# EAGLE design main (EAGLE 5.11)
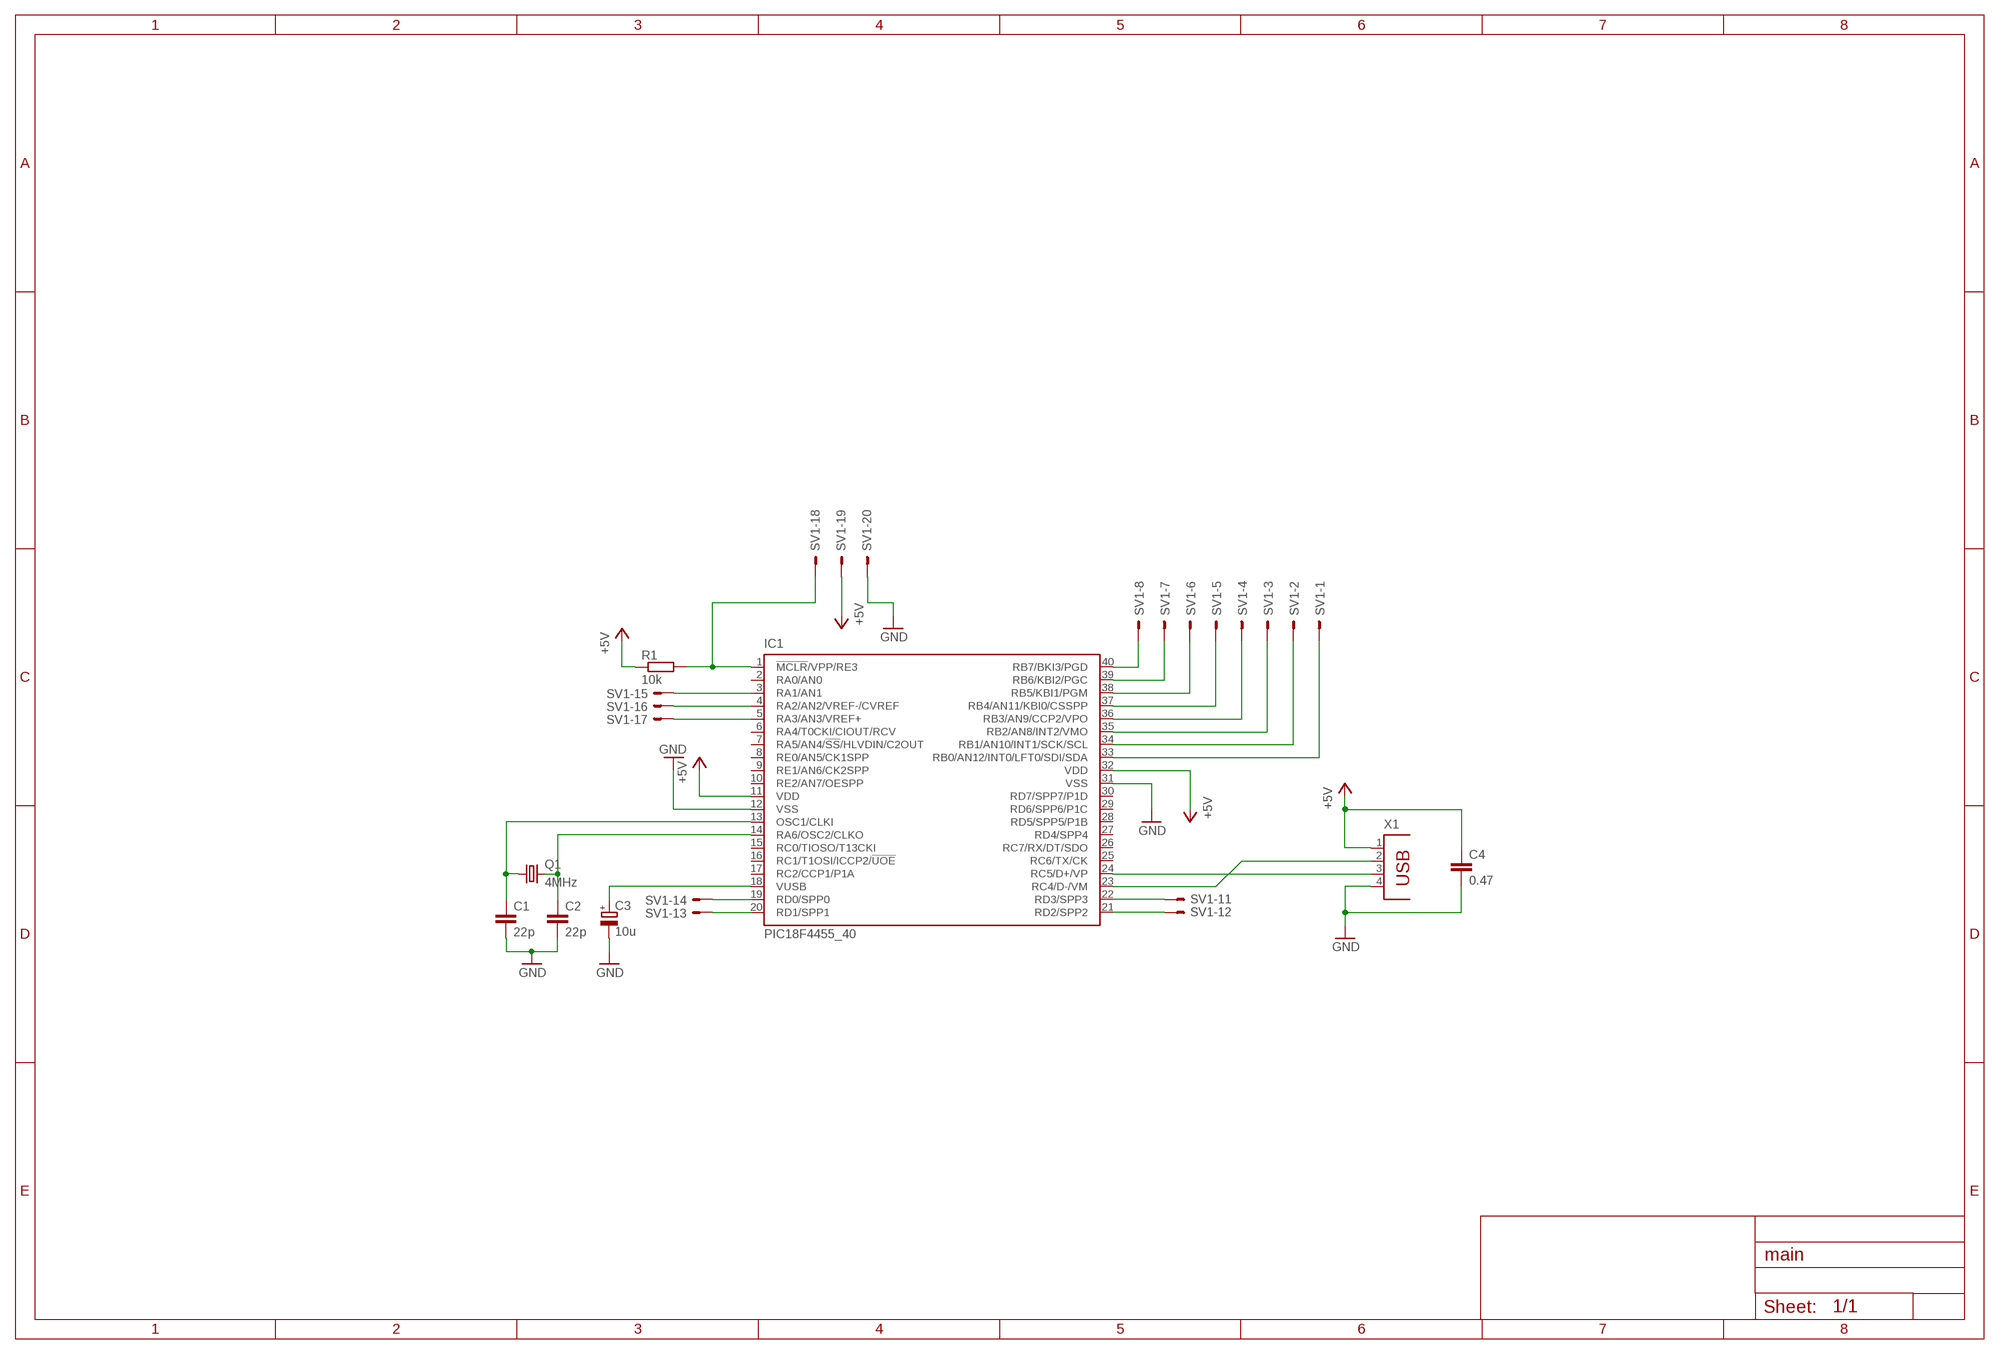
[diagram p0: schematic, sheet 1]

## Parts
C1  22p  C-EU025-030X050  [C025-030X050]
C2  22p  C-EU025-030X050  [C025-030X050]
C3  10u  CPOL-EUE2.5-7  [E2,5-7]
C4  0.47  C-EU025-030X050  [C025-030X050]
IC1  PIC18F4455_40  [DIL40]
Q1  4MHz  CRYSTALHC18U-V  [HC18U-V]
R1  10k  R-EU_0207/10  [0207/10]
SV1  ML20LE  [ML20L]
X1  PN87520  [PN87520]

## Nets
+5V: C4.1 IC1.11(VDD) IC1.32(VDD) R1.1 SV1.19 X1.1
GND: C1.2 C2.2 C3.- C4.2 IC1.12(VSS) IC1.31(VSS) SV1.20 X1.4
N$1: IC1.24(RC5/D+/VP) X1.3
N$2: IC1.23(RC4/D-/VM) X1.2
N$3: IC1.40(RB7/BKI3/PGD) SV1.8
N$4: C1.1 IC1.13(OSC1/CLKI) Q1.1
N$5: C2.1 IC1.14(RA6/OSC2/CLKO) Q1.2
N$6: IC1.39(RB6/KBI2/PGC) SV1.7
N$7: C3.+ IC1.18(VUSB)
N$8: IC1.1(!MCLR!/VPP/RE3) R1.2 SV1.18
N$9: IC1.3(RA1/AN1) SV1.15
N$10: IC1.4(RA2/AN2/VREF-/CVREF) SV1.16
N$11: IC1.5(RA3/AN3/VREF+) SV1.17
N$12: IC1.19(RD0/SPP0) SV1.14
N$13: IC1.20(RD1/SPP1) SV1.13
N$14: IC1.22(RD3/SPP3) SV1.11
N$15: IC1.21(RD2/SPP2) SV1.12
N$16: IC1.38(RB5/KBI1/PGM) SV1.6
N$17: IC1.37(RB4/AN11/KBI0/CSSPP) SV1.5
N$18: IC1.36(RB3/AN9/CCP2/VPO) SV1.4
N$19: IC1.35(RB2/AN8/INT2/VMO) SV1.3
N$20: IC1.34(RB1/AN10/INT1/SCK/SCL) SV1.2
N$21: IC1.33(RB0/AN12/INT0/LFT0/SDI/SDA) SV1.1
Unconnected: IC1.2(RA0/AN0) IC1.6(RA4/T0CKI/CIOUT/RCV) IC1.7(RA5/AN4/!SS!/HLVDIN/C2OUT) IC1.8(RE0/AN5/CK1SPP) IC1.9(RE1/AN6/CK2SPP) IC1.10(RE2/AN7/OESPP) IC1.15(RC0/TIOSO/T13CKI) IC1.16(RC1/T1OSI/ICCP2/!UOE) IC1.17(RC2/CCP1/P1A) IC1.25(RC6/TX/CK) IC1.26(RC7/RX/DT/SDO) IC1.27(RD4/SPP4) IC1.28(RD5/SPP5/P1B) IC1.29(RD6/SPP6/P1C) IC1.30(RD7/SPP7/P1D) SV1.9 SV1.10

## Library data of the parts
C1 C2 C4 = resistor:C-EU: CAPACITOR, European symbol
C3 = resistor:CPOL-EU: POLARIZED CAPACITOR, European symbol
IC1 = microchip:PIC18F4*_40: USB Microcontrollers with nanoWatt Technology High-Performance, Enhanced Flash, 28/40/44-Pin, Source: http://ww1.microchip.com/downloads/en/devicedoc/39632c.pdf; MF: MICROCHIP; MPN: PIC18F4455-I/P; OC_FARNELL: 9321314; OC_NEWARK: 05K2028
Q1 = crystal:CRYSTAL: CRYSTAL; OC_FARNELL: unknown; OC_NEWARK: unknown
R1 = resistor:R-EU_: RESISTOR, European symbol
SV1 = con-ml:ML20LE: HARTING; OC_FARNELL: unknown; OC_NEWARK: unknown
X1 = con-berg:PN87520: BERG USB connector; OC_FARNELL: unknown; OC_NEWARK: unknown

## Board
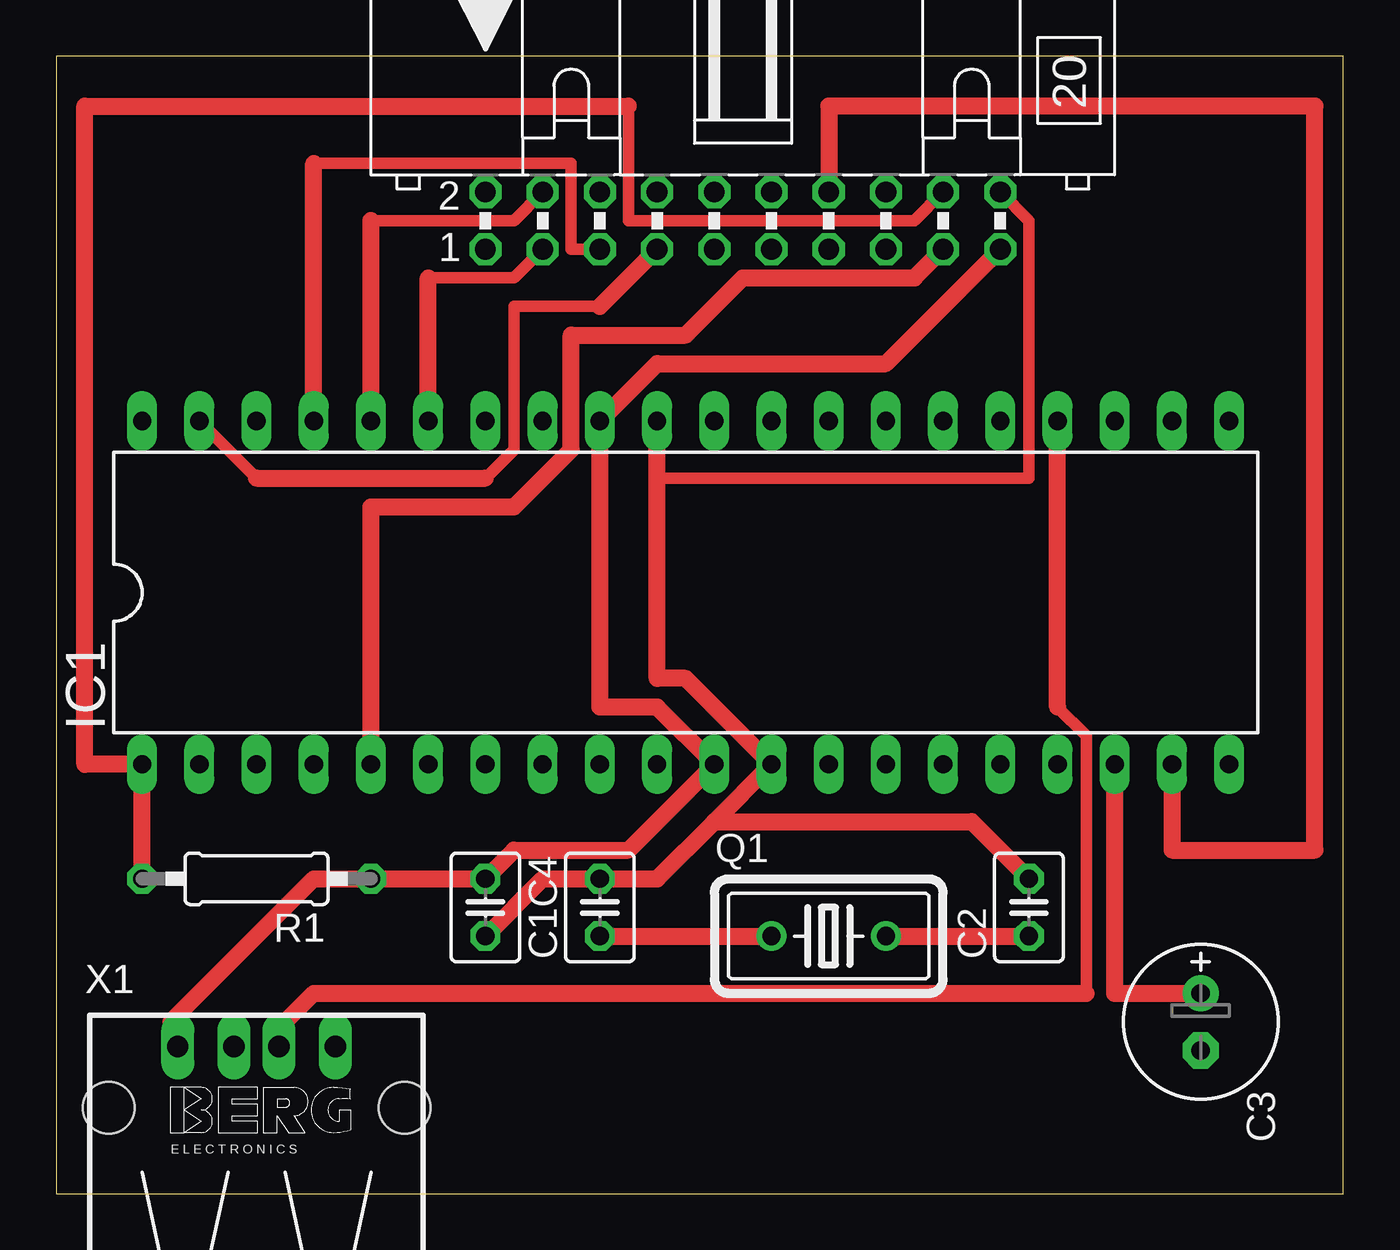
[diagram p1: board, top side]
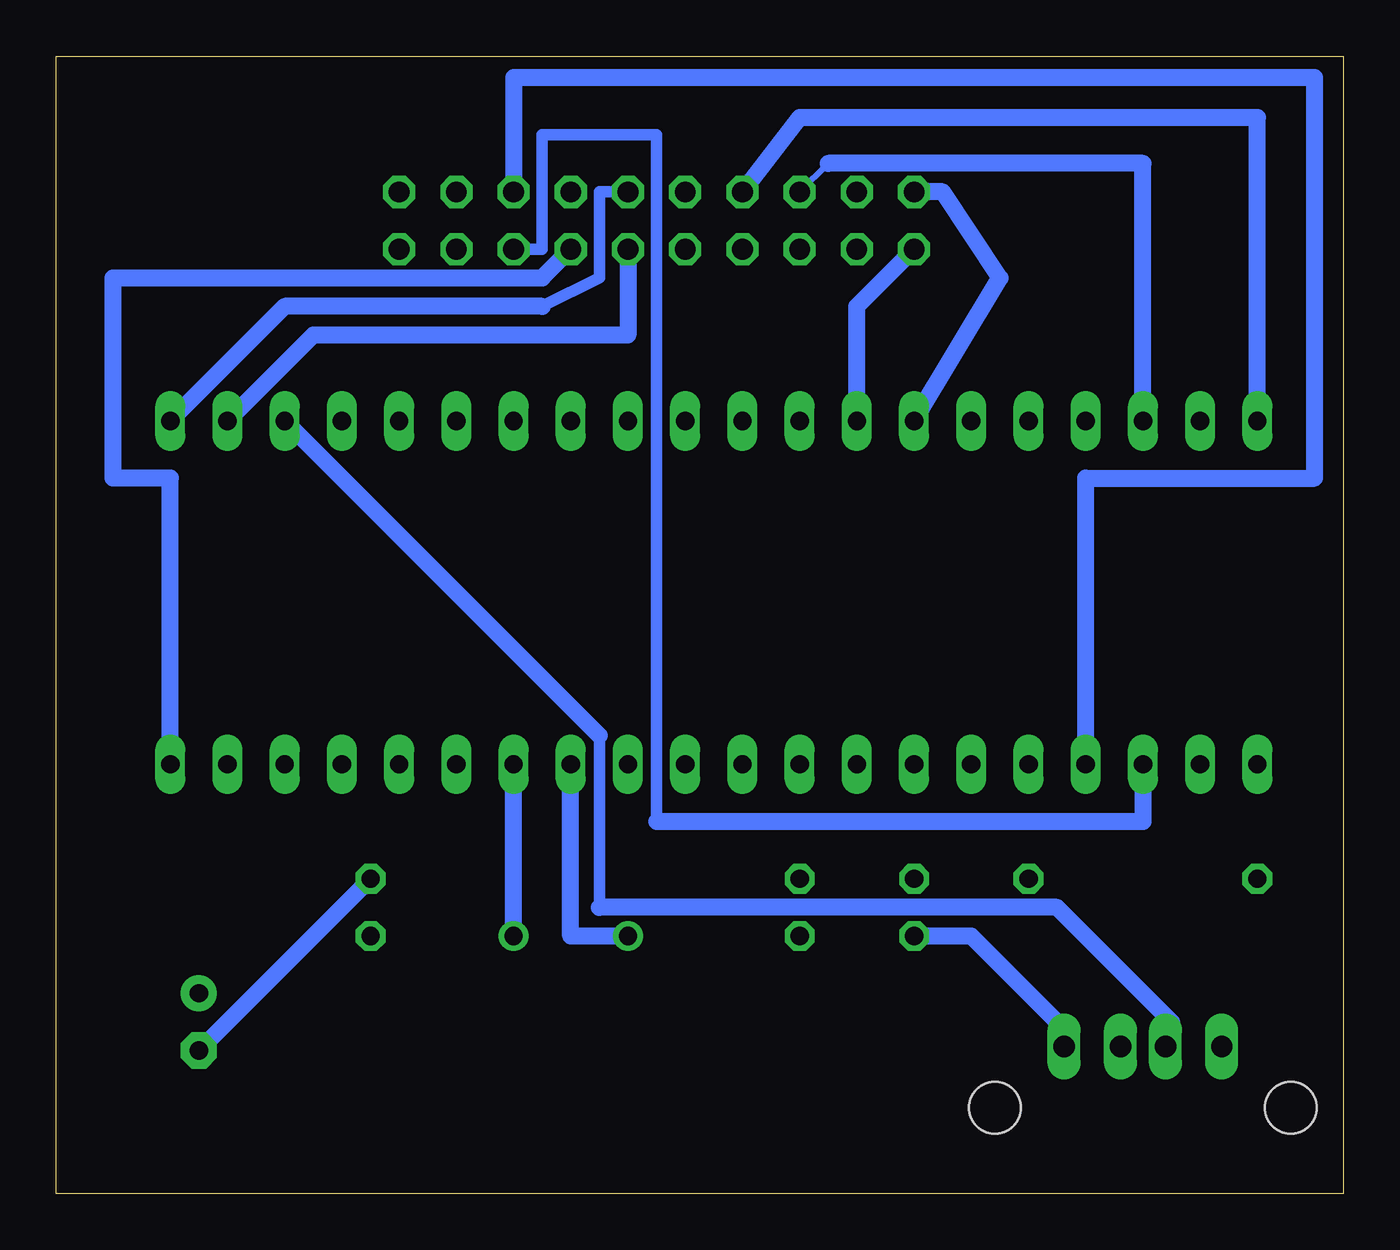
[diagram p2: board, bottom side, seen from below]

Size 57.13 x 50.47 mm. Coordinates in mm from the lower left corner, seen from the top.
Outline: 0,0 57.13,0 57.13,50.47 0,50.47 0,0
Copper layers (1*16): Top 0.035mm / dielectric 1.5mm / Bottom 0.035mm
Design rules "default": minimum track width 10mil, minimum drill 24mil, track to track 8mil, track to pad 8mil, pad to pad 8mil, via to via 8mil, smd to smd 8mil, copper to edge 40mil, drill to drill 8mil, minimum pad ring 10mil, minimum via ring 8mil, stop-mask expansion 4mil, vias tented up to drill 0mil, thermal gap 10mil

### Footprints (pad centres in the part's own frame; a part is rotated, then mirrored left to right if it is on the bottom)
C025-030X050 = drill 0.813 octagon: 1 -1.27,0; 2 1.27,0
E2,5-7 = drill 0.813 pad 1.6 round: + -1.27,0 | drill 0.813 pad 1.6 octagon: - 1.27,0
DIL40 = drill 0.813 long: 1 -24.13,-7.62; 2 -21.59,-7.62; 3 -19.05,-7.62; 4 -16.51,-7.62; 5 -13.97,-7.62; 6 -11.43,-7.62; 7 -8.89,-7.62; 8 -6.35,-7.62; 9 -3.81,-7.62; 10 -1.27,-7.62; 11 1.27,-7.62; 12 3.81,-7.62; 13 6.35,-7.62; 14 8.89,-7.62; 15 11.43,-7.62; 16 13.97,-7.62; 17 16.51,-7.62; 18 19.05,-7.62; 19 21.59,-7.62; 20 24.13,-7.62; 21 24.13,7.62; 22 21.59,7.62; 23 19.05,7.62; 24 16.51,7.62; 25 13.97,7.62; 26 11.43,7.62; 27 8.89,7.62; 28 6.35,7.62; 29 3.81,7.62; 30 1.27,7.62; 31 -1.27,7.62; 32 -3.81,7.62; 33 -6.35,7.62; 34 -8.89,7.62; 35 -11.43,7.62; 36 -13.97,7.62; 37 -16.51,7.62; 38 -19.05,7.62; 39 -21.59,7.62; 40 -24.13,7.62
HC18U-V = drill 0.813 round: 1 -2.54,0; 2 2.54,0
0207/10 = drill 0.813 octagon: 1 -5.08,0; 2 5.08,0
ML20L = drill 0.914 octagon: 1 -11.43,-1.27; 2 -11.43,1.27; 3 -8.89,-1.27; 4 -8.89,1.27; 5 -6.35,-1.27; 6 -6.35,1.27; 7 -3.81,-1.27; 8 -3.81,1.27; 9 -1.27,-1.27; 10 -1.27,1.27; 11 1.27,-1.27; 12 1.27,1.27; 13 3.81,-1.27; 14 3.81,1.27; 15 6.35,-1.27; 16 6.35,1.27; 17 8.89,-1.27; 18 8.89,1.27; 19 11.43,-1.27; 20 11.43,1.27
PN87520 = drill 0.95 long: 1 -3.5,2.71; 2 -1,2.71; 3 1,2.71; 4 3.5,2.71 | hole 2.3: -6.57,0; 6.57,0

### Placement (x,y rotation side)
C1  24.13,12.7 90 top
C2  43.18,12.7 90 top
C3  50.8,7.62 270 top
C4  19.05,12.7 270 top
IC1  27.94,26.67 0 top
Q1  34.29,11.43 0 top
R1  8.89,13.97 180 top
SV1  30.48,43.18 0 top
X1  8.89,3.81 0 top

### Tracks (layer width: path | path; a pad name or v marks a point on that pad's centre or on a via)
+5V
  Top 0.762: SV1.19 36.83,36.83 26.67,36.83 IC1.32 24.13,21.59 26.67,21.59 IC1.11 25.4,15.24 20.32,15.24 C4.1 R1.1 11.43,13.97 5.08,7.62 X1.1
GND
  Top 0.508: SV1.20 43.18,43.18 43.18,31.75 26.67,31.75
  Top 0.762: C4.2 21.59,13.97 C1.2 26.67,13.97 29.21,16.51 | 29.21,16.51 IC1.12 27.94,22.86 26.67,22.86 26.67,31.75 IC1.31 | C2.2 40.64,16.51 29.21,16.51
  Bottom 0.762: C2.2 C3.- | C4.2 16.51,11.43 12.7,7.62 X1.4
N$1
  Top 0.508: 44.45,21.59 45.72,20.32 45.72,8.89
  Top 0.762: 44.45,21.59 IC1.24 | 45.72,8.89 11.43,8.89 10.16,7.62 X1.3
N$2
  Bottom 0.508: 33.02,12.7 33.02,20.32
  Bottom 0.762: 33.02,20.32 IC1.23 | 33.02,12.7 12.7,12.7 7.62,7.62 X1.2
N$3
  Bottom 0.762: IC1.40 3.81,47.75 24.13,47.75 SV1.8
N$4
  Top 0.762: C1.1 Q1.1
  Bottom 0.762: IC1.13 34.29,11.43 Q1.1
N$5
  Top 0.762: Q1.2 C2.1
  Bottom 0.762: Q1.2 IC1.14
N$6
  Top 0.508: IC1.39 8.89,31.75 | 19.05,31.75 20.32,33.02 20.32,39.37 24.13,39.37
  Top 0.762: 8.89,31.75 19.05,31.75 | 24.13,39.37 SV1.7
N$7
  Top 0.762: IC1.18 46.99,8.89 C3.+
N$8
  Top 0.508: SV1.18 38.1,43.18 25.4,43.18 25.4,48.26
  Top 0.762: R1.2 IC1.1 1.27,19.05 1.27,48.26 25.4,48.26
N$9
  Bottom 0.508: 30.48,16.51 30.48,46.99 35.56,46.99 35.56,41.91 SV1.15
  Bottom 0.762: IC1.3 8.89,16.51 30.48,16.51
N$10
  Bottom 0.762: IC1.4 11.43,31.75 1.27,31.75 1.27,49.53 36.83,49.53 SV1.16
N$11
  Top 0.762: IC1.5 13.97,30.48 20.32,30.48 22.86,33.02 22.86,38.1 27.94,38.1 30.48,40.64 38.1,40.64 SV1.17
N$12
  Top 0.762: IC1.19 49.53,15.24 55.88,15.24 55.88,48.26 34.29,48.26 SV1.14
N$13
  Bottom 0.762: IC1.20 52.07,31.75 54.61,31.75 54.61,40.64 35.56,40.64 SV1.13
N$14
  Bottom 0.762: IC1.22 45.72,38.1 31.75,38.1 SV1.11
N$15
  Bottom 0.508: 35.56,39.37 33.02,40.64 33.02,44.45 SV1.12
  Bottom 0.762: IC1.21 46.99,39.37 35.56,39.37
N$16
  Bottom 0.254: 22.86,45.72 SV1.6
  Bottom 0.762: IC1.38 8.89,45.72 22.86,45.72
N$17
  Top 0.508: 11.43,45.72 22.86,45.72 22.86,41.91 SV1.5
  Top 0.762: IC1.37 11.43,45.72
N$18
  Top 0.508: 13.97,43.18 20.32,43.18 SV1.4
  Top 0.762: IC1.36 13.97,43.18
N$19
  Top 0.508: 16.51,40.64 20.32,40.64 SV1.3
  Top 0.762: IC1.35 16.51,40.64
N$20
  Bottom 0.762: IC1.34 15.24,40.64 17.78,44.45 SV1.2
N$21
  Bottom 0.762: IC1.33 21.59,39.37 SV1.1